# EAGLE schematic MH-M38-Bluetooth-audio-receiver-circuit (EAGLE 7.6.0)
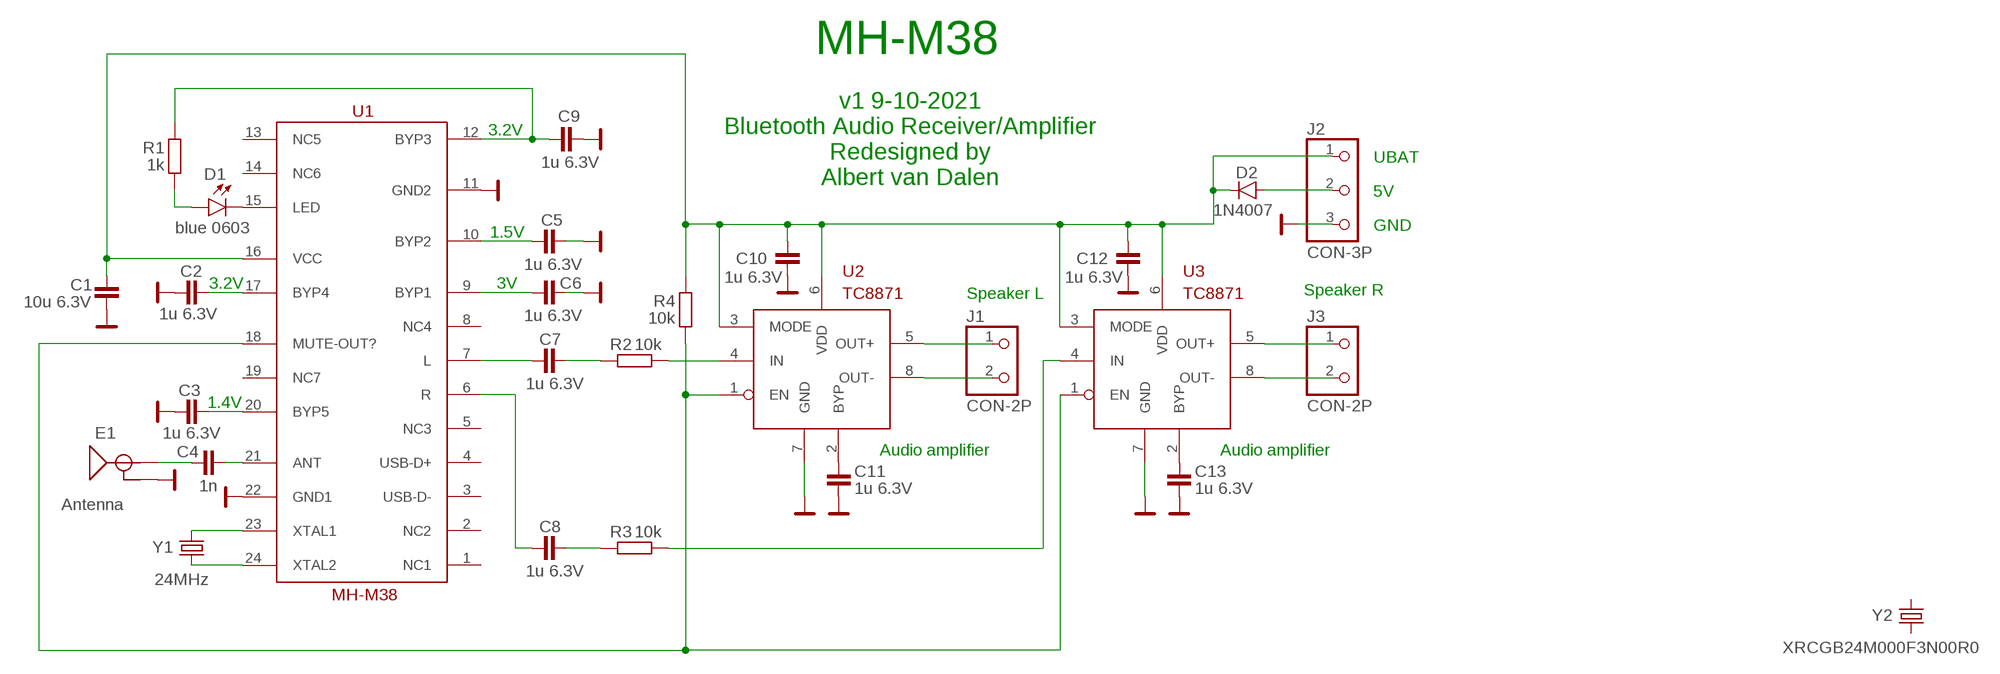
[diagram p0: schematic, sheet 1]

## Parts
C1  10u 6.3V  SMD-C-0603-SMALL  [0603-SMALL]
C2  1u 6.3V  SMD-C-0402-SMALL  [0402-SMALL]
C3  1u 6.3V  SMD-C-0402-SMALL  [0402-SMALL]
C4  1n  SMD-C-0402-SMALL  [0402-SMALL]
C5  1u 6.3V  SMD-C-0402-SMALL  [0402-SMALL]
C6  1u 6.3V  SMD-C-0402-SMALL  [0402-SMALL]
C7  1u 6.3V  SMD-C-0402-SMALL  [0402-SMALL]
C8  1u 6.3V  SMD-C-0402-SMALL  [0402-SMALL]
C9  1u 6.3V  SMD-C-0402-SMALL  [0402-SMALL]
C10  1u 6.3V  SMD-C-0402-SMALL  [0402-SMALL]
C11  1u 6.3V  SMD-C-0402-SMALL  [0402-SMALL]
C12  1u 6.3V  SMD-C-0402-SMALL  [0402-SMALL]
C13  1u 6.3V  SMD-C-0402-SMALL  [0402-SMALL]
D1  blue 0603  LED  [LED-0603]
D2  1N4007  DIODE-SMD  [SOD-323]
E1  Antenna  ANTENNATRACE-15.2MM  [TRACE_ANTENNA_2.4GHZ_15.2MM]
J1  CON-2P  [JST-2]
J2  CON-3P  [JST-3]
J3  CON-2P  [JST-2]
R1  1k  SMD-R-0402-SMALL  [0402-SMALL]
R2  10k  SMD-R-0402-SMALL  [0402-SMALL]
R3  10k  SMD-R-0402-SMALL  [0402-SMALL]
R4  10k  SMD-R-0402-SMALL  [0402-SMALL]
U1  MH-M38  [TSSOP24-0.65-7.8X4.4MM]
U2  TC8871  [SO08]
U3  TC8871  [SO08]
Y1  24MHz  CRYSTAL-SMD128  [FA-128]
Y2  XRCGB24M000F3N00R0  CRYSTAL-SMD128  [FA-128]

## Nets
3.7V1: C1.1 C10.1 C12.1 D2.C J2.1 R4.2 U1.16(VCC) U2.3(MODE) U2.6(VDD) U3.3(MODE) U3.6(VDD)
GND: C1.2 C2.2 C3.2 C5.2 C6.2 C9.2 C10.2 C11.2 C12.2 C13.2 E1.GND J2.3 U1.11(GND2) U1.22(GND1) U2.7(GND) U3.7(GND)
N$1: D1.A R1.1
N$2: D1.C U1.15(LED)
N$3: C3.1 U1.20(BYP5)
N$4: C2.1 U1.17(BYP4)
N$5: D2.A J2.2
N$6: C4.1 U1.21(ANT)
N$7: U1.23(XTAL1) Y1.3
N$8: U1.24(XTAL2) Y1.1
N$9: C4.2 E1.ANT(SIGNAL)
N$10: C9.1 R1.2 U1.12(BYP3)
N$11: C5.1 U1.10(BYP2)
N$12: C6.1 U1.9(BYP1)
N$13: C11.1 U2.2(BYP)
N$14: C7.2 R2.1
N$15: C7.1 U1.7(L)
N$16: C8.2 R3.1
N$17: R2.2 U2.4(IN)
N$18: J1.1 U2.5(OUT+)
N$19: J1.2 U2.8(OUT-)
N$20: R4.1 U1.18(MUTE-OUT?) U2.1(EN) U3.1(EN)
N$21: C13.1 U3.2(BYP)
N$23: J3.1 U3.5(OUT+)
N$24: J3.2 U3.8(OUT-)
N$25: R3.2 U3.4(IN)
N$26: C8.1 U1.6(R)
Unconnected: U1.1(NC1) U1.2(NC2) U1.3(USB-D-) U1.4(USB-D+) U1.5(NC3) U1.8(NC4) U1.13(NC5) U1.14(NC6) U1.19(NC7) Y2.1 Y2.3

## Notes on the sheet
- MH-M38
- 3.2V
- UBAT
- v1 9-10-2021
  Bluetooth Audio Receiver/Amplifier
  Redesigned by
  Albert van Dalen
- 5V
- GND
- 1.5V
- 3.2V | 3V
- Speaker L | Speaker R
- 1.4V
- Audio amplifier | Audio amplifier

## Library data of the parts
C1-C13 = Albert:SMD-C: Capacitors ...4.7uF @ 6.3V -> 0402 ...10uF @ 16V -> 0603 ...22uF @ 25V -> 0805
D1 = Albert:LED
D2 = Albert:DIODE-SMD
E1 = SparkFun-RF:ANTENNA: Chip antenna Chip antenna with ground or secondary connection. Common with larger metal RF connectors.
J1 J3 = Albert:CON-2P
J2 = Albert:CON-3P
R1-R4 = Albert:SMD-R: Resistors all kinds in 0603 and 0402
U1 = Albert:MH-M38
U2 U3 = Albert:TC8871
Y1 Y2 = Albert:CRYSTAL-SMD: 32,768KHz - SMD

## Net classes
0 default: width 0.406 mm
2 GND: width 0.406 mm